# Altium schematic sheet LM35.SchDoc
size 76 x 43 mm
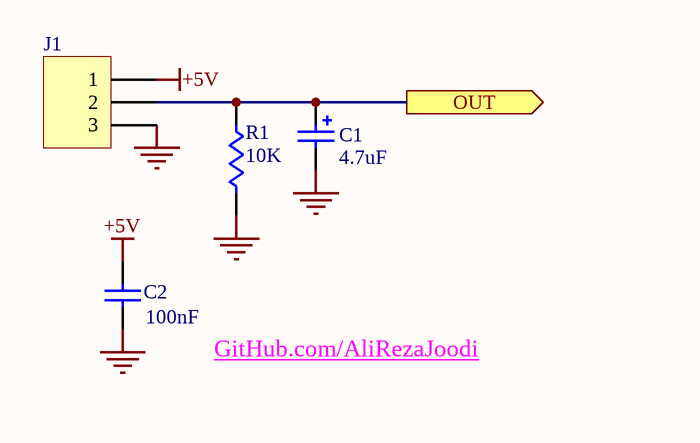
[diagram p0: LM35.SchDoc]

## Parts
C1  value 4.7uF  [CAPPR2.5-6.3x5]  (hidden comment: Capacitor)
C2  value 100nF  [CAPNTO2.54-3.05x1.78A]  (hidden comment: Capacitor)
J1  Header  [Fonics_3PIN_1]  (value not drawn)
R1  value 10K  [AXIAL-0.4]  (hidden comment: Resistor)

## Ports
OUT (out)

## Nets
+5V: C2.1 J1.1
GND: C1.2 C2.2 J1.3 R1.2
OUT: C1.1 J1.2 R1.1 ; port OUT

## Notes on the sheet
- GitHub.com/AliRezaJoodi

## Library data of the parts
C1 = Cap Pol1: Polarized Capacitor (Radial); Manufacturer: Generic Components; Class I: Passive; Published: 8-Jun-2000; Revision: July-2002: Re-released for DXP Platform.; Publisher: Altium Limited; Class II: Capacitor
C2 = Cap: Published: 8-Jun-2000; LatestRevisionDate: 17-Jul-2002; LatestRevisionNote: Re-released for DXP Platform.; PackageReference: RAD-0.3; Publisher: Altium Limited
J1 = Header 3: Header, 3-Pin; Manufacturer: Generic Components; Class I: Connector; Revision: July-2002: Re-released for DXP Platform.; Publisher: Altium Limited
R1 = Res1: Manufacturer: Generic Components; Class I: Passive; Published: 8-Jun-2000; Revision: July-2002: Re-released for DXP Platform.; Publisher: Altium Limited; Class II: Resistor